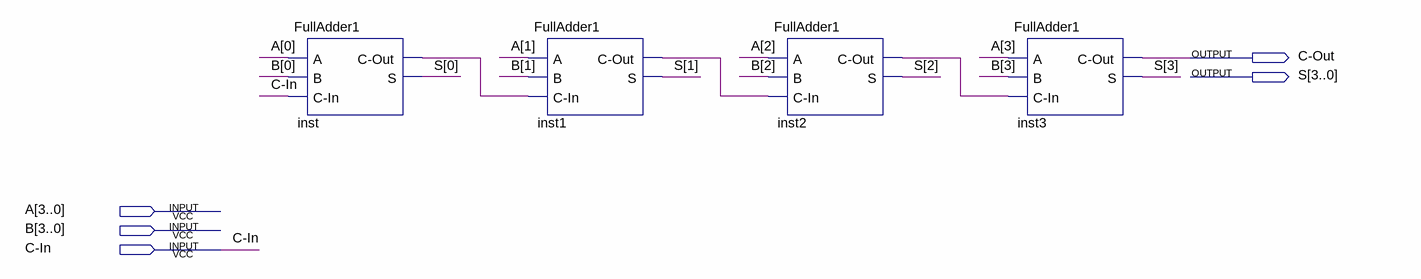
[diagram p0: schematic sheet]
// Quartus schematic FullAdder4.bdf as structural Verilog: 4 symbols, 5 pins
module FullAdder4 (
  input  [3:0] A,
  input  [3:0] B,
  input  \C-In ,
  output \C-Out ,
  output [3:0] S
);

  wire inst1_c_out, inst2_c_out, inst_c_out;

  FullAdder1 inst (.A(A[0]), .B(B[0]), .\C-In (\C-In ), .\C-Out (inst_c_out), .S(S[0]));
  FullAdder1 inst1 (.A(A[1]), .B(B[1]), .\C-In (inst_c_out), .\C-Out (inst1_c_out), .S(S[1]));
  FullAdder1 inst2 (.A(A[2]), .B(B[2]), .\C-In (inst1_c_out), .\C-Out (inst2_c_out), .S(S[2]));
  FullAdder1 inst3 (.A(A[3]), .B(B[3]), .\C-In (inst2_c_out), .\C-Out (\C-Out ), .S(S[3]));
endmodule
